# EAGLE design STEP6 (EAGLE 9.4.2)
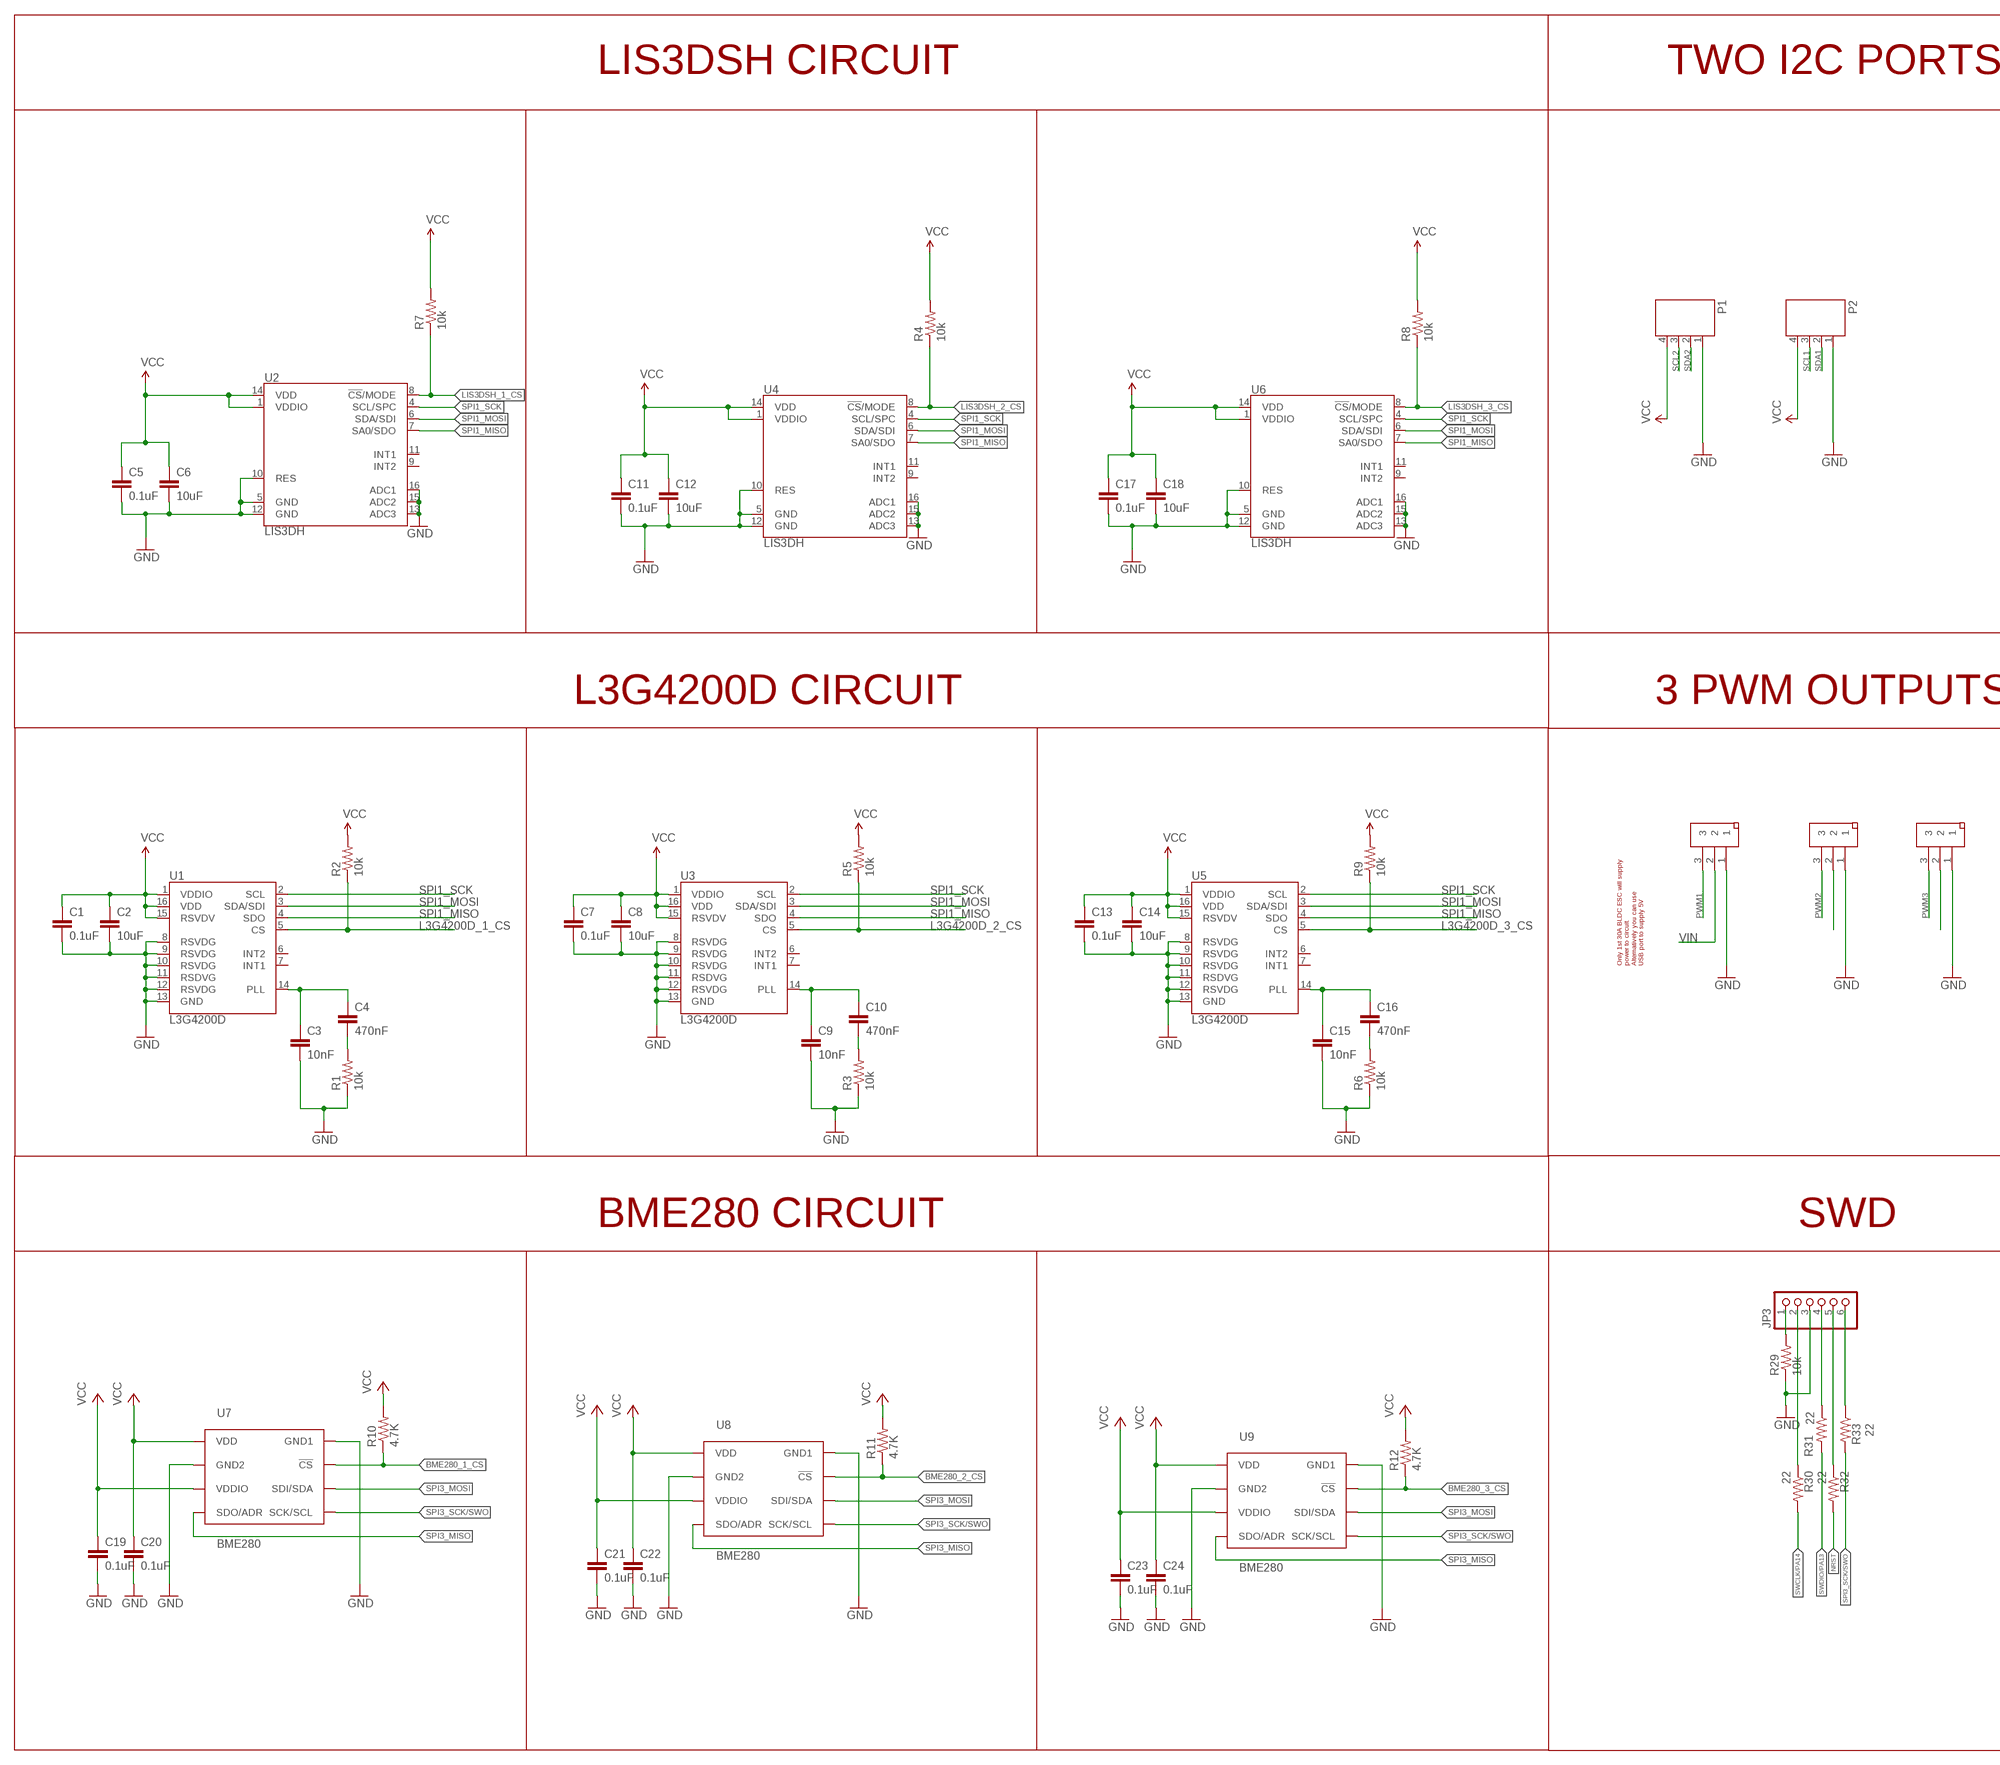
[diagram p0: schematic, sheet 1, part 1 of 2]
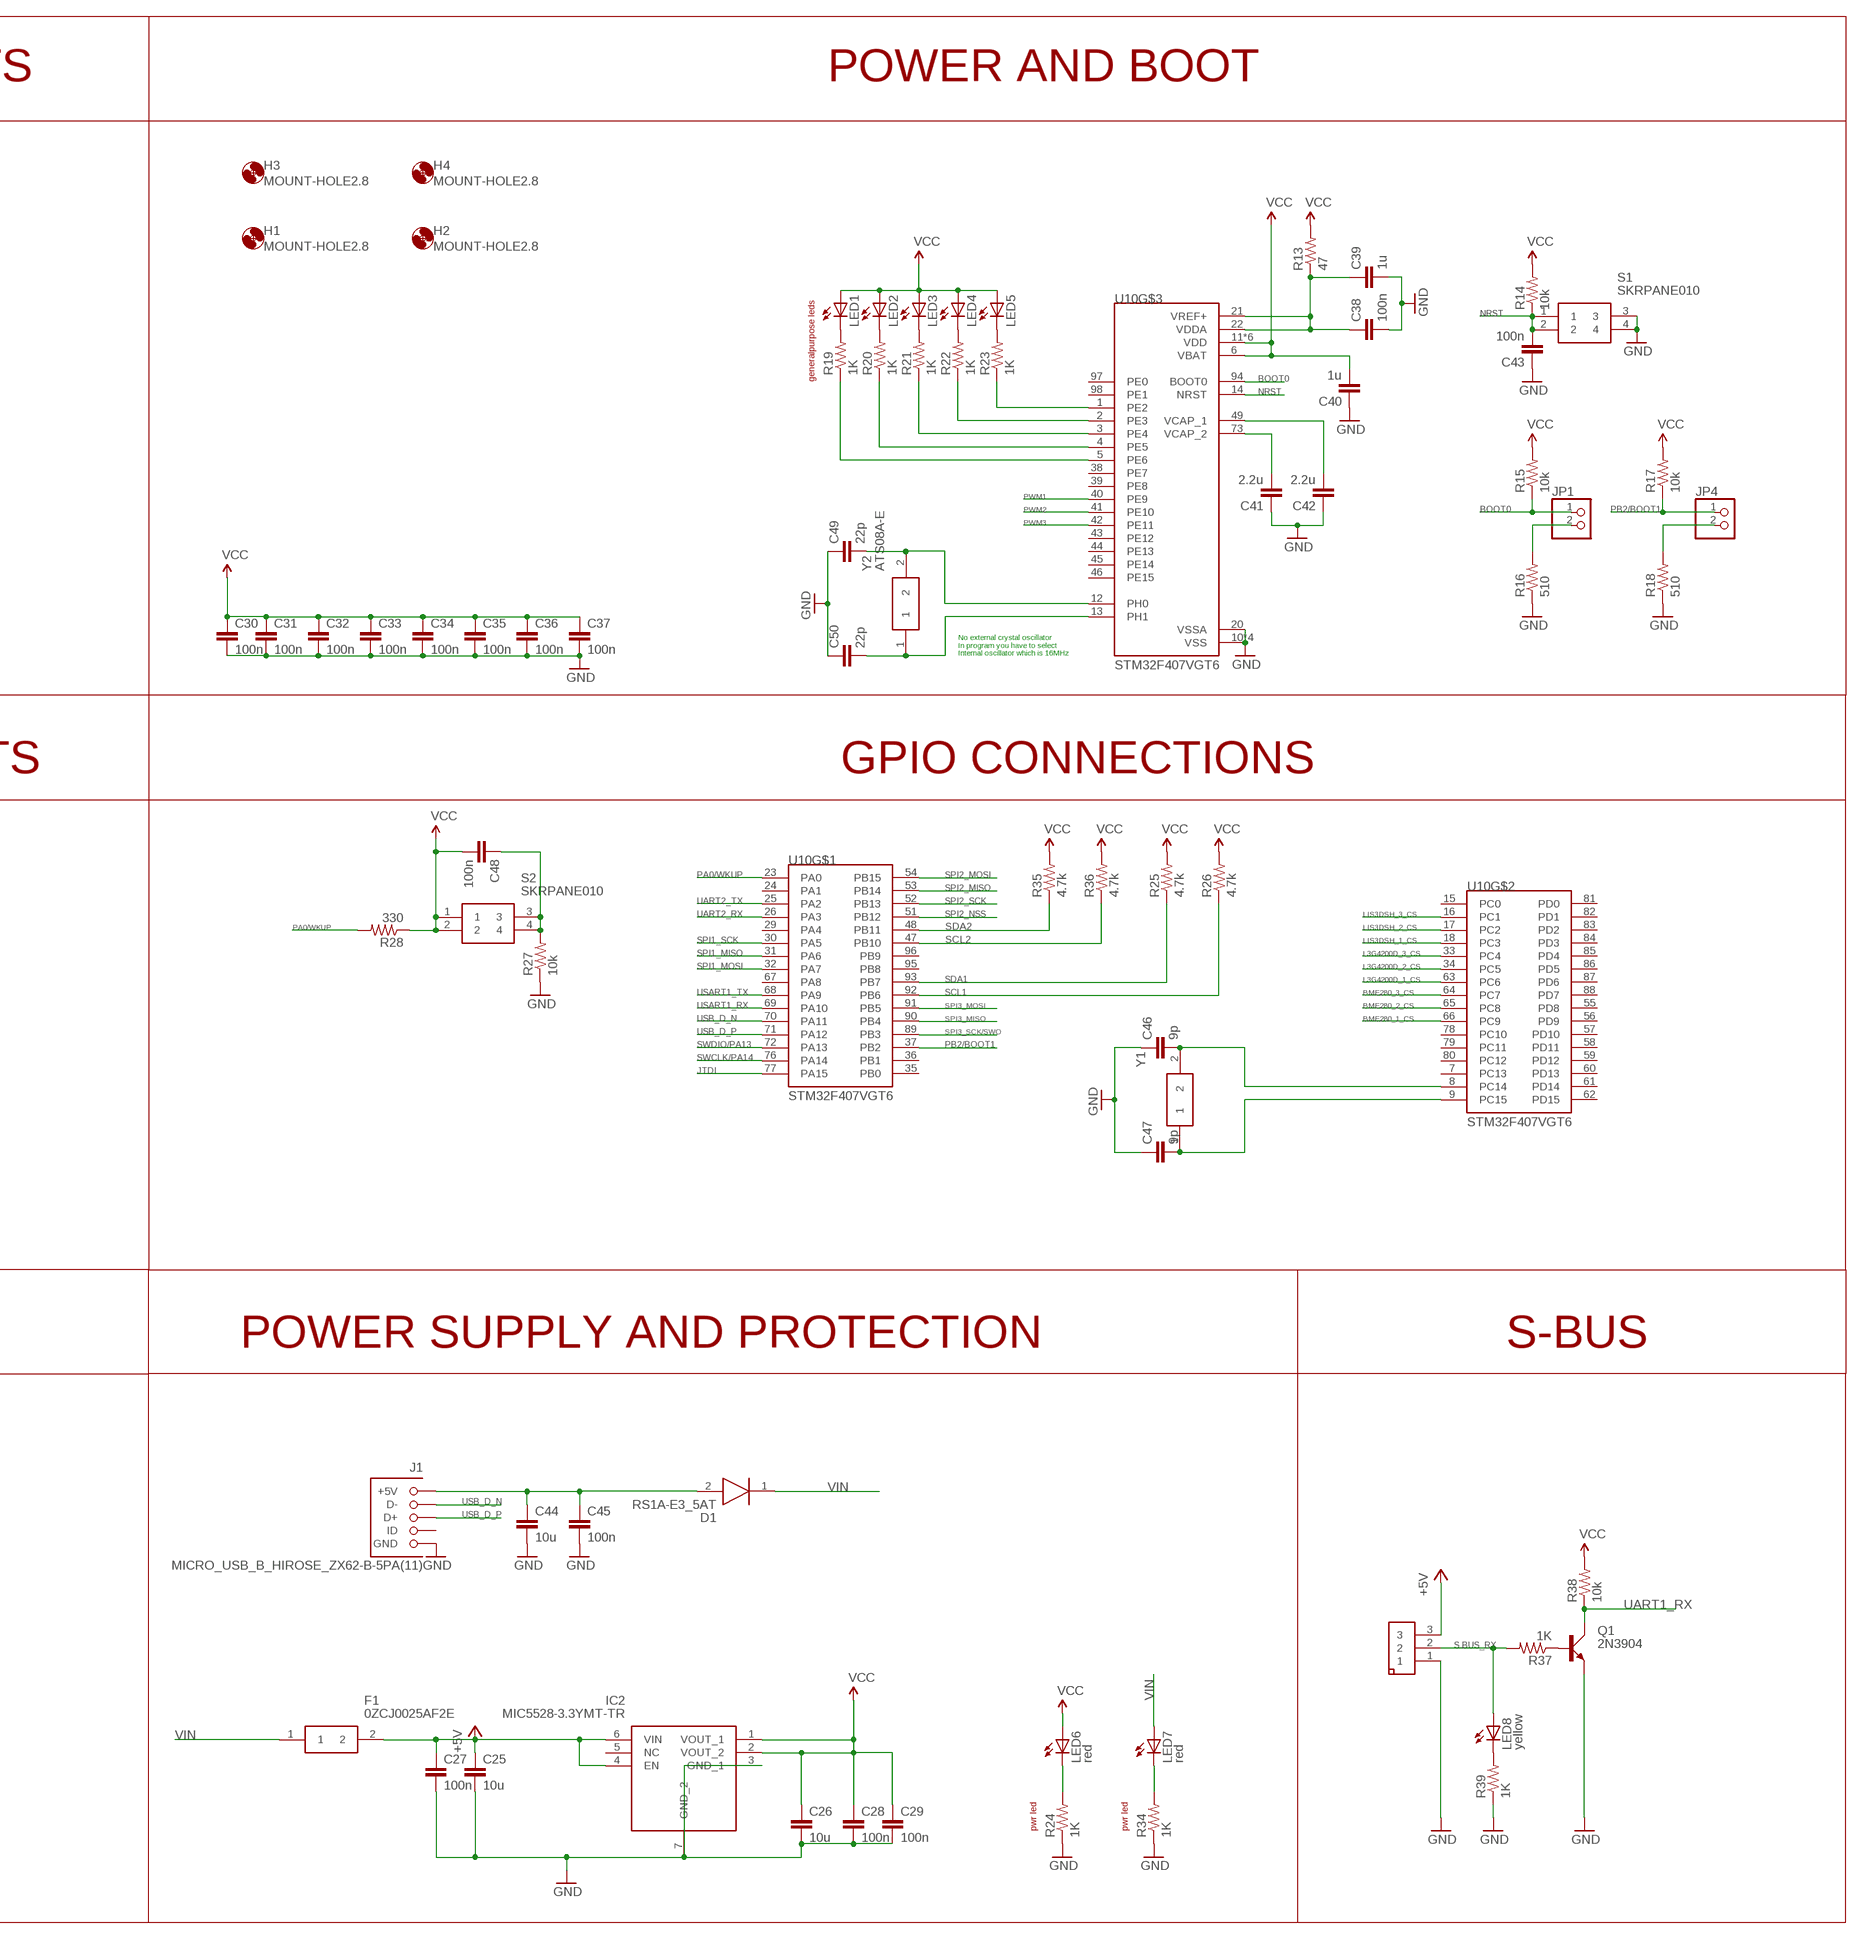
[diagram p1: schematic, sheet 1, part 2 of 2]

## Parts
C1  0.1uF  CAP0402-CAP  [0402-CAP]
C2  10uF  CAP1206  [1206]
C3  10nF  CAP0402-CAP  [0402-CAP]
C4  470nF  CAP0402-CAP  [0402-CAP]
C5  0.1uF  0.1UF-0402-16V-10%  [0402]
C6  10uF  10UF-0603-6.3V-20%  [0603]
C7  0.1uF  CAP0402-CAP  [0402-CAP]
C8  10uF  CAP1206  [1206]
C9  10nF  CAP0402-CAP  [0402-CAP]
C10  470nF  CAP0402-CAP  [0402-CAP]
C11  0.1uF  0.1UF-0402-16V-10%  [0402]
C12  10uF  10UF-0603-6.3V-20%  [0603]
C13  0.1uF  CAP0402-CAP  [0402-CAP]
C14  10uF  CAP1206  [1206]
C15  10nF  CAP0402-CAP  [0402-CAP]
C16  470nF  CAP0402-CAP  [0402-CAP]
C17  0.1uF  0.1UF-0402-16V-10%  [0402]
C18  10uF  10UF-0603-6.3V-20%  [0603]
C19  0.1uF  0.1UF-25V-5%(0603)  [0603-CAP]
C20  0.1uF  0.1UF-25V-5%(0603)  [0603-CAP]
C21  0.1uF  0.1UF-25V-5%(0603)  [0603-CAP]
C22  0.1uF  0.1UF-25V-5%(0603)  [0603-CAP]
C23  0.1uF  0.1UF-25V-5%(0603)  [0603-CAP]
C24  0.1uF  0.1UF-25V-5%(0603)  [0603-CAP]
C25  10u  C-EUC0805  [C0805]
C26  10u  C-EUC0805  [C0805]
C27  100n  C-EUC0402  [C0402]
C28  100n  C-EUC0402  [C0402]
C29  100n  C-EUC0402  [C0402]
C30  100n  C-EUC0402  [C0402]
C31  100n  C-EUC0402  [C0402]
C32  100n  C-EUC0402  [C0402]
C33  100n  C-EUC0402  [C0402]
C34  100n  C-EUC0402  [C0402]
C35  100n  C-EUC0402  [C0402]
C36  100n  C-EUC0402  [C0402]
C37  100n  C-EUC0402  [C0402]
C38  100n  C-EUC0402  [C0402]
C39  1u  C-EUC0402  [C0402]
C40  1u  C-EUC0402  [C0402]
C41  2.2u  C-EUC0603  [C0603]
C42  2.2u  C-EUC0603  [C0603]
C43  100n  C-EUC0402  [C0402]
C44  10u  C-EUC0805  [C0805]
C45  100n  C-EUC0402  [C0402]
C46  9p  C-EUC0402  [C0402]
C47  9p  C-EUC0402  [C0402]
C48  100n  C-EUC0402  [C0402]
C49  22p  C-EUC0402  [C0402]
C50  22p  C-EUC0402  [C0402]
D1  RS1A-E3_5AT  [DIOM5127X229N]
F1  0ZCJ0025AF2E  [FUSC3216X75N]
H1  MOUNT-HOLE2.8  [2,8]
H2  MOUNT-HOLE2.8  [2,8]
H3  MOUNT-HOLE2.8  [2,8]
H4  MOUNT-HOLE2.8  [2,8]
IC2  MIC5528-3.3YMT-TR  [SON40P120X120X60-7N]
J1  MICRO_USB_B_HIROSE_ZX62-B-5PA(11)  [USB_MICRO_B-HIROSE-ZX62-B-5PA(11)]
JP1  PINHD-1X2  [1X02]
JP3  PINHD-1X6  [1X06]
JP4  PINHD-1X2  [1X02]
LED1  LEDCHIP-LED0603  [CHIP-LED0603]
LED2  LEDCHIP-LED0603  [CHIP-LED0603]
LED3  LEDCHIP-LED0603  [CHIP-LED0603]
LED4  LEDCHIP-LED0603  [CHIP-LED0603]
LED5  LEDCHIP-LED0603  [CHIP-LED0603]
LED6  red  LEDCHIP-LED0603  [CHIP-LED0603]
LED7  red  LEDCHIP-LED0603  [CHIP-LED0603]
LED8  yellow  LEDCHIP-LED0603  [CHIP-LED0603]
P1  JST-PH4  [JST-PH4]
P2  JST-PH4  [JST-PH4]
Q1  2N3904  [SOT23]
R1  10k  RESISTOR0402-RES  [0402-RES]
R2  10k  RESISTOR0402-RES  [0402-RES]
R3  10k  RESISTOR0402-RES  [0402-RES]
R4  10k  R-US_R0402  [R0402]
R5  10k  RESISTOR0402-RES  [0402-RES]
R6  10k  RESISTOR0402-RES  [0402-RES]
R7  10k  R-US_R0402  [R0402]
R8  10k  R-US_R0402  [R0402]
R9  10k  RESISTOR0402-RES  [0402-RES]
R10  4.7K  R-US_R0402  [R0402]
R11  4.7K  R-US_R0402  [R0402]
R12  4.7K  R-US_R0402  [R0402]
R13  47  R-US_R1206  [R1206]
R14  10k  R-US_R0402  [R0402]
R15  10k  R-US_R0402  [R0402]
R16  510  R-US_R0402  [R0402]
R17  10k  R-US_R0402  [R0402]
R18  510  R-US_R0402  [R0402]
R19  1K  R-US_R0402  [R0402]
R20  1K  R-US_R0402  [R0402]
R21  1K  R-US_R0402  [R0402]
R22  1K  R-US_R0402  [R0402]
R23  1K  R-US_R0402  [R0402]
R24  1K  R-US_R0402  [R0402]
R25  4.7k  R-US_R0402  [R0402]
R26  4.7k  R-US_R0402  [R0402]
R27  10k  R-US_R0402  [R0402]
R28  330  R-US_R0402  [R0402]
R29  10k  RESISTOR0402-RES  [0402-RES]
R30  22  RESISTOR0402-RES  [0402-RES]
R31  22  RESISTOR0402-RES  [0402-RES]
R32  22  RESISTOR0402-RES  [0402-RES]
R33  22  RESISTOR0402-RES  [0402-RES]
R34  1K  R-US_R0402  [R0402]
R35  4.7k  R-US_R0402  [R0402]
R36  4.7k  R-US_R0402  [R0402]
R37  1K  R-US_R0402  [R0402]
R38  10k  R-US_R0402  [R0402]
R39  1K  R-US_R0402  [R0402]
S1  SKRPANE010  [SKRPADE010]
S2  SKRPANE010  [SKRPADE010]
U1  L3G4200D  [LGA16-4X4]
U2  LIS3DH  [LGA-16-3X3]
U3  L3G4200D  [LGA16-4X4]
U4  LIS3DH  [LGA-16-3X3]
U5  L3G4200D  [LGA16-4X4]
U6  LIS3DH  [LGA-16-3X3]
U7  BME280  [BME280_LGA]
U8  BME280  [BME280_LGA]
U9  BME280  [BME280_LGA]
U10  STM32F407VGT6  [QFP50P1600X1600X160-100N]
U$1  JST-PH3  [JST-PH3]
U$2  JST-PH3  [JST-PH3]
U$3  JST-PH3  [JST-PH3]
U$4  JST-PH3  [JST-PH3]
Y1  CM7V-T1A-32.768K-9PF-20PPM-TA-  [CM7VT1A32768KHZ125PF10PPMTBQC]
Y2  ATS08A-E  [ATS041C-E]

## Nets
+5V: C25.1 C27.1 F1.2 IC2.4(EN) IC2.6(VIN) U$4.3
BME280_1_CS: R10.1 U7.P$2(!CS) U10.66(PC9)
BME280_2_CS: R11.1 U8.P$2(!CS) U10.65(PC8)
BME280_3_CS: R12.1 U9.P$2(!CS) U10.64(PC7)
BOOT0: JP1.1 R15.1 U10.94(BOOT0)
GND: C1.2 C2.2 C3.2 C5.2 C6.2 C7.2 C8.2 C9.2 C11.2 C12.2 C13.2 C14.2 C15.2 C17.2 C18.2 C19.2 C20.2 C21.2 C22.2 C23.2 C24.2 C25.2 C26.2 C27.2 C28.2 C29.2 C30.2 C31.2 C32.2 C33.2 C34.2 C35.2 C36.2 C37.2 C38.2 C39.2 C40.1 C41.1 C42.1 C43.1 C44.2 C45.2 C46.1 C47.1 C49.1 C50.1 IC2.3(GND_1) IC2.7(GND_2) J1.5(GND) JP3.3 P1.1 P2.1 Q1.2(E) R1.1 R3.1 R6.1 R16.1 R18.1 R24.1 R27.1 R29.1 R34.1 R39.1 S1.3 S1.4 U1.8(RSVDG) U1.9(RSVDG) U1.10(RSVDG) U1.11(RSDVG) U1.12(RSVDG) U1.13(GND) U2.5(GND) U2.10(RES) U2.12(GND) U2.13(ADC3) U2.15(ADC2) U2.16(ADC1) U3.8(RSVDG) U3.9(RSVDG) U3.10(RSVDG) U3.11(RSDVG) U3.12(RSVDG) U3.13(GND) U4.5(GND) U4.10(RES) U4.12(GND) U4.13(ADC3) U4.15(ADC2) U4.16(ADC1) U5.8(RSVDG) U5.9(RSVDG) U5.10(RSVDG) U5.11(RSDVG) U5.12(RSVDG) U5.13(GND) U6.5(GND) U6.10(RES) U6.12(GND) U6.13(ADC3) U6.15(ADC2) U6.16(ADC1) U7.P$1(GND1) U7.P$7(GND2) U8.P$1(GND1) U8.P$7(GND2) U9.P$1(GND1) U9.P$7(GND2) U10.10(VSS) U10.20(VSSA) U10.27(VSS) U10.74(VSS) U10.99(VSS) U$1.1 U$2.1 U$3.1 U$4.1
JTDI: U10.77(PA15)
L3G4200D_1_CS: R2.1 U1.5(CS) U10.63(PC6)
L3G4200D_2_CS: R5.1 U3.5(CS) U10.34(PC5)
L3G4200D_3_CS: R9.1 U5.5(CS) U10.33(PC4)
LIS3DSH_1_CS: R7.1 U2.8(!CS!/MODE) U10.18(PC3)
LIS3DSH_2_CS: R4.1 U4.8(!CS!/MODE) U10.17(PC2)
LIS3DSH_3_CS: R8.1 U6.8(!CS!/MODE) U10.16(PC1)
N$10: C42.2 U10.49(VCAP_1)
N$11: C38.1 C39.1 R13.1 U10.21(VREF+) U10.22(VDDA)
N$12: C41.2 U10.73(VCAP_2)
N$13: JP1.2 R16.2
N$14: LED1.C R19.2
N$15: JP4.2 R18.2
N$16: LED2.C R20.2
N$17: LED3.C R21.2
N$18: LED4.C R22.2
N$19: LED5.C R23.2
N$20: R23.1 U10.1(PE2)
N$21: LED6.C R24.2
N$22: R22.1 U10.2(PE3)
N$23: R21.1 U10.3(PE4)
N$24: R20.1 U10.4(PE5)
N$25: R19.1 U10.5(PE6)
N$26: C46.2 U10.8(PC14) Y1.2
N$27: C47.2 U10.9(PC15) Y1.1
N$28: C48.1 R27.2 S2.3 S2.4
N$29: JP3.1 R29.2
N$30: JP3.2 R30.1
N$31: JP3.4 R31.1
N$32: JP3.5 R32.1
N$33: JP3.6 R33.1
N$34: C49.2 U10.12(PH0) Y2.2
N$35: C50.2 U10.13(PH1) Y2.1
N$36: U$3.2
N$37: LED7.C R34.2
N$39: U$2.2
N$40: Q1.1(B) R37.1
N$41: LED8.C R39.2
NRST: C43.2 R14.1 R32.2 S1.1 S1.2 U10.14(NRST)
PA0/WKUP: R28.2 U10.23(PA0)
PB2/BOOT1: JP4.1 R17.1 U10.37(PB2)
PLL: C3.1 C4.1 U1.14(PLL)
PLL1: C9.1 C10.1 U3.14(PLL)
PLL2: C15.1 C16.1 U5.14(PLL)
PLL-1: C10.2 R3.2
PLL-2: C4.2 R1.2
PLL-3: C16.2 R6.2
PWM1: U10.40(PE9) U$1.3
PWM2: U10.41(PE10) U$2.3
PWM3: U10.42(PE11) U$3.3
S.BUS_RX: LED8.A R37.2 U$4.2
SCL1: P2.3 R26.1 U10.92(PB6)
SCL2: P1.3 R36.1 U10.47(PB10)
SDA1: P2.2 R25.1 U10.93(PB7)
SDA2: P1.2 R35.1 U10.48(PB11)
SPI1_MISO: U1.4(SDO) U2.7(SA0/SDO) U3.4(SDO) U4.7(SA0/SDO) U5.4(SDO) U6.7(SA0/SDO) U10.31(PA6)
SPI1_MOSI: U1.3(SDA/SDI) U2.6(SDA/SDI) U3.3(SDA/SDI) U4.6(SDA/SDI) U5.3(SDA/SDI) U6.6(SDA/SDI) U10.32(PA7)
SPI1_SCK: U1.2(SCL) U2.4(SCL/SPC) U3.2(SCL) U4.4(SCL/SPC) U5.2(SCL) U6.4(SCL/SPC) U10.30(PA5)
SPI2_MISO: U10.53(PB14)
SPI2_MOSI: U10.54(PB15)
SPI2_NSS: U10.51(PB12)
SPI2_SCK: U10.52(PB13)
SPI3_MISO: U7.P$5(SDO/ADR) U8.P$5(SDO/ADR) U9.P$5(SDO/ADR) U10.90(PB4)
SPI3_MOSI: U7.P$3(SDI/SDA) U8.P$3(SDI/SDA) U9.P$3(SDI/SDA) U10.91(PB5)
SPI3_SCK/SWO: R33.2 U7.P$4(SCK/SCL) U8.P$4(SCK/SCL) U9.P$4(SCK/SCL) U10.89(PB3)
SWCLK/PA14: R30.2 U10.76(PA14)
SWDIO/PA13: R31.2 U10.72(PA13)
UART1_RX: Q1.3(C) R38.1
UART2_RX: U10.26(PA3)
UART2_TX: U10.25(PA2)
USART1_RX: U10.69(PA10)
USART1_TX: U10.68(PA9)
USB_D_N: J1.2(D-) U10.70(PA11)
USB_D_P: J1.3(D+) U10.71(PA12)
VCC: C1.1 C2.1 C5.1 C6.1 C7.1 C8.1 C11.1 C12.1 C13.1 C14.1 C17.1 C18.1 C19.1 C20.1 C21.1 C22.1 C23.1 C24.1 C26.1 C28.1 C29.1 C30.1 C31.1 C32.1 C33.1 C34.1 C35.1 C36.1 C37.1 C40.2 C48.2 IC2.1(VOUT_1) IC2.2(VOUT_2) LED1.A LED2.A LED3.A LED4.A LED5.A LED6.A P1.4 P2.4 R2.2 R4.2 R5.2 R7.2 R8.2 R9.2 R10.2 R11.2 R12.2 R13.2 R14.2 R15.2 R17.2 R25.2 R26.2 R28.1 R35.2 R36.2 R38.2 S2.1 S2.2 U1.1(VDDIO) U1.15(RSVDV) U1.16(VDD) U2.1(VDDIO) U2.14(VDD) U3.1(VDDIO) U3.15(RSVDV) U3.16(VDD) U4.1(VDDIO) U4.14(VDD) U5.1(VDDIO) U5.15(RSVDV) U5.16(VDD) U6.1(VDDIO) U6.14(VDD) U7.P$6(VDDIO) U7.P$8(VDD) U8.P$6(VDDIO) U8.P$8(VDD) U9.P$6(VDDIO) U9.P$8(VDD) U10.6(VBAT) U10.11(VDD) U10.19(VDD) U10.28(VDD) U10.50(VDD) U10.75(VDD) U10.100(VDD)
VIN: D1.1(K) F1.1 LED7.A U$1.2
VUSB: C44.1 C45.1 D1.2(A) J1.1(+5V)
Unconnected: IC2.5(NC) J1.4(ID) U1.6(INT2) U1.7(INT1) U2.9(INT2) U2.11(INT1) U3.6(INT2) U3.7(INT1) U4.9(INT2) U4.11(INT1) U5.6(INT2) U5.7(INT1) U6.9(INT2) U6.11(INT1) U10.7(PC13) U10.15(PC0) U10.24(PA1) U10.29(PA4) U10.35(PB0) U10.36(PB1) U10.38(PE7) U10.39(PE8) U10.43(PE12) U10.44(PE13) U10.45(PE14) U10.46(PE15) U10.55(PD8) U10.56(PD9) U10.57(PD10) U10.58(PD11) U10.59(PD12) U10.60(PD13) U10.61(PD14) U10.62(PD15) U10.67(PA8) U10.78(PC10) U10.79(PC11) U10.80(PC12) U10.81(PD0) U10.82(PD1) U10.83(PD2) U10.84(PD3) U10.85(PD4) U10.86(PD5) U10.87(PD6) U10.88(PD7) U10.95(PB8) U10.96(PB9) U10.97(PE0) U10.98(PE1)

## Notes on the sheet
- LIS3DSH CIRCUIT | TWO I2C PORTS | POWER AND BOOT
- generalpurpose leds
- No external crystal oscillator
  In program you have to select
  Internal oscillator which is 16MHz
- L3G4200D CIRCUIT | 3 PWM OUTPUTS | GPIO CONNECTIONS
- Only 1st 30A BLDC ESC will supply
  power to circuit.
  Alternatively you can use 
  USB port to supply 5V
- BME280 CIRCUIT | SWD | POWER SUPPLY AND PROTECTION | S-BUS
- pwr led | pwr led

## Library data of the parts
C1-C4 C7-C10 C13-C16 = SparkFun:CAP: Capacitor Standard 0603 ceramic capacitor, and 0.1" leaded capacitor.
C5 C11 C17 = SparkFun-Capacitors:0.1UF: 0.1µF ceramic capacitors A capacitor is a passive two-terminal electrical component used to store electrical energy temporarily in an electric field.; PROD_ID: CAP-12416
C6 C12 C18 = SparkFun-Capacitors:10UF: 10.0µF ceramic capacitors A capacitor is a passive two-terminal electrical component used to store electrical energy temporarily in an electric field.; PROD_ID: CAP-11015
C19-C24 = SparkFun-Capacitors:0.1UF-25V-5%(0603): CAP-08604; PROD_ID: CAP-08604
C25-C50 = rcl:C-EU: CAPACITOR, European symbol
D1 = SamacSys_Parts:RS1A-E3_5AT: VISHAY - RS1A-E3/5AT - DIODE, FAST, 1A, 50V, SMD Source: Datasheet <https://www.vishay.com/docs/88707/rs1a.pdf>; DESCRIPTION: VISHAY - RS1A-E3/5AT - DIODE, FAST, 1A, 50V, SMD; HEIGHT: 2.29mm; MANUFACTURER_NAME: Vishay; MANUFACTURER_PART_NUMBER: RS1A-E3/5AT; MOUSER_PART_NUMBER: 625-RS1A-E3/5AT; MOUSER_PRICE-STOCK: https://www.mouser.com/Search/Refine.aspx?Keyword=625-RS1A-E3%2F5AT
F1 = SamacSys_Parts:0ZCJ0025AF2E: BEL FUSE - CIRCUIT PROTECTION - 0ZCJ0025AF2E - FUSE, RESETTABLE PTC, 24VDC, 0.25A, SMD Source: Datasheet <https://www.belfuse.com/resources/CircuitProtection/datasheets/0ZCJ Nov2016.pdf>; DESCRIPTION: BEL FUSE - CIRCUIT PROTECTION - 0ZCJ0025AF2E - FUSE, RESETTABLE PTC, 24VDC, 0.25A, SMD; HEIGHT: 0.75mm; MANUFACTURER_NAME: BEL CIRCUIT PROTECTION; MANUFACTURER_PART_NUMBER: 0ZCJ0025AF2E
H1-H4 = holes:MOUNT-HOLE: MOUNTING HOLE with drill center marker
IC2 = SamacSys_Parts:MIC5528-3.3YMT-TR: LDO Voltage Regulators High-Performance 500mA LDO Source: Datasheet <https://componentsearchengine.com/Datasheets/1/MIC5528-3.3YMT-TR.pdf>; DESCRIPTION: LDO Voltage Regulators High-Performance 500mA LDO; HEIGHT: 0.6mm; MANUFACTURER_NAME: Microchip; MANUFACTURER_PART_NUMBER: MIC5528-3.3YMT-TR; MOUSER_PART_NUMBER: 998-MIC5528-3.3YMTTR; MOUSER_PRICE-STOCK: https://www.mouser.com/Search/Refine.aspx?Keyword=998-MIC5528-3.3YMTTR; RS_PART_NUMBER: 1773292P; RS_PRICE-STOCK: http://uk.rs-online.com/web/p/products/1773292P
J1 = connector:MICRO_USB_B_HIROSE_ZX62-B-5PA(11): Connector Receptacle USB - micro B 2.0 5 Position Surface Mount, Right Angle, Horizontal Bottom Mount; DIGIKEY: H11634CT-ND; MOUSER: 798-ZX62-B-5PA11; NEWARK: 86P8793
JP1 JP4 = pinhead:PINHD-1X2: PIN HEADER
JP3 = pinhead:PINHD-1X6: PIN HEADER
LED1-LED8 = led:LED: LED OSRAM: - CHIPLED LG R971, LG N971, LY N971, LG Q971, LY Q971, LO R971, LY R971 LH N974, LH R974 LS Q976, LO Q976, LY Q976 LO Q996 - Hyper CHIPLED LW Q18S LB Q993, LB Q99A, LB R99A - SideLED LS A670, LO A670, LY A670, LG A670, LP A670 LB A673, LV A673, LT A673, LW A673 LH A674 LY A675 LS A676, LA A676, LO A676, LY A676, LW A676 LS A679, LY A679, LG A679 - Hyper Micro SIDELED® LS Y876, LA Y876, LO Y876, LY Y876 LT Y87S - SmartLED LW L88C, LW L88S LB L89C, LB L89S, LG L890 LS L89K, LO L89K, LY L89K LS L896, LA L896, LO L896, LY L896 - TOPLED LS T670, LO T670, LY T670, LG T670, LP T670 LSG T670, LSP T670, LSY T670, LOP T670, LYG T670 LG T671, LOG T671, LSG T671 LB T673, LV T673, LT T673, LW T673 LH T674 LS T676, LA T676, LO T676, LY T676, LB T676, LH T676, LSB T676, LW T676 LB T67C, LV T67C, LT T67C, LS T67K, LO T67K, LY T67K, LW E67C LS E67B, LA E67B, LO E67B, LY E67B, LB E67C, LV E67C, LT E67C LW T67C LS T679, LY T679, LG T679 LS T770, LO T770, LY T770, LG T770, LP T770 LB T773, LV T773, LT T773, LW T773 LH T774 LS E675, LA E675, LY E675, LS T675 LS T776, LA T776, LO T776, LY T776, LB T776 LHGB T686 LT T68C, LB T68C - Hyper Mini TOPLED® LB M676 - Mini TOPLED Santana® LG M470 LS M47K, LO M47K, LY M47K Source: http://www.osram.convergy.de LUXEON: - LUMILED® LXK2-PW12-R00, LXK2-PW12-S00, LXK2-PW14-U00, LXK2-PW14-V00 LXK2-PM12-R00, LXK2-PM12-S00, LXK2-PM14-U00 LXK2-PE12-Q00, LXK2-PE12-R00, LXK2-PE12-S00, LXK2-PE14-T00, LXK2-PE14-U00 LXK2-PB12-K00, LXK2-PB12-L00, LXK2-PB12-M00, LXK2-PB14-N00, LXK2-PB14-P00, LXK2-PB14-Q00 LXK2-PR12-L00, LXK2-PR12-M00, LXK2-PR14-Q00, LXK2-PR14-R00 LXK2-PD12-Q00, LXK2-PD12-R00, LXK2-PD12-S00 LXK2-PH12-R00, LXK2-PH12-S00 LXK2-PL12-P00, LXK2-PL12-Q00, LXK2-PL12-R00 Source: www.luxeon.com KINGBRIGHT: KA-3528ASYC Source: www.kingbright.com
P1 P2 = jst-ph:JST-PH4
Q1 = transistor-small-signal:2N3904: NPN TRANSISTOR
R1-R3 R5 R6 R9 R29-R33 = SparkFun:RESISTOR: Resistor Basic schematic elements and footprints for 0603, 1206, and PTH resistors.
R4 R7 R8 R10-R28 R34-R39 = rcl:R-US_: RESISTOR, American symbol
S1 S2 = SamacSys_Parts:SKRPANE010: Tactile Switches 500mOhm 1.57N 16VDC 4.2X3.2X2.5MM 50mA Source: Datasheet <https://www.alps.com/prod/info/E/HTML/Tact/SurfaceMount/SKRP/SKRPANE010.html>; DESCRIPTION: Tactile Switches 500mOhm 1.57N 16VDC 4.2X3.2X2.5MM 50mA; HEIGHT: 2mm; MANUFACTURER_NAME: ALPS; MANUFACTURER_PART_NUMBER: SKRPANE010; MOUSER_PART_NUMBER: 688-SKRPANE010; MOUSER_PRICE-STOCK: https://www.mouser.com/Search/Refine.aspx?Keyword=688-SKRPANE010
U1 U3 U5 = SparkFun:L3G4200D: L3G4200D Three-axis, digital output gyroscope The L3G4200D is a low-power three-axis angular rate sensor, has a full scale of ±250/±500/±2000 dps and is capable of measuring rates with a user-selectable bandwidth. It includes a sensing element and an IC interface capable of providing the measured angular rate to the external world through a digital interface (I2C/SPI). Package: 4x4x1.1 LGA-16 (LGA16-4x4.PAC)
U2 U4 U6 = SparkFun-Sensors:LIS3DH: ST Microelectronics LIS3DH 3-Axis ±2/4/8/16g SPI/I2C Accelerometer The LIS3DH is a three axis MEMS linear accelerometer in the "nano" family. It has a digital I2C/SPI serial interface which makes it ideal for using in embedded applications. The device also features ultra low-power operational modes that allow advanced power saving and smart sleep to wake-up functions, built in detections with interrupts, and auxiliary ADC inputs Datasheet-XXXX <http://www.sparkfun.com/datasheets/Sensors/Accelerometer/LIS3DH.pdf> SparkFun Products SparkFun Triple Axis Accelerometer Breakout - LIS3DH <https://www.sparkfun.com/products/10345> (SEN-XXXXX) Triple Axis Accelerometer - LIS3DH <https://www.sparkfun.com/products/9755> (SEN-XXXXX); PROD_ID: IC-13419; SF_ID: N/A
U7-U9 = BME280ComponentLibrary:BME280; PROD_ID: IC-13090
U10 = STM32F407VGT6:STM32F407VGT6: STM32 Series 32-bit 1 MB Flash 192 kB RAM ARM Based Microcontroller - LQFP-100; AVAILABILITY: Unavailable; DESCRIPTION: STM32 Series 32-bit 1 MB Flash 192 kB RAM ARM Based Microcontroller - LQFP-100; MF: STMicroelectronics; MP: STM32F407VGT6; PACKAGE: LQFP-100 STMicroelectronics; PRICE: None
U$1-U$4 = jst-ph:JST-PH3
Y1 = SamacSys_Parts:CM7V-T1A-32.768K-9PF-20PPM-TA-: Crystals 32.768 kHz 9.0 pF +/-20 PPM AEC-Q200 Source: Datasheet <https://componentsearchengine.com/Datasheets/1/CM7V-T1A-32.768k-9pF-20PPM-TA-QA T3.pdf>; DESCRIPTION: Crystals 32.768 kHz 9.0 pF +/-20 PPM AEC-Q200; HEIGHT: 0.65mm; MANUFACTURER_NAME: MICRO CRYSTAL; MANUFACTURER_PART_NUMBER: CM7V-T1A-32.768k-9pF-20PPM-TA-QA T3; MOUSER_PART_NUMBER: 428-201568-MG03; MOUSER_PRICE-STOCK: https://www.mouser.com/Search/Refine.aspx?Keyword=428-201568-MG03
Y2 = SamacSys_Parts:ATS08A-E: Crystals 8MHz 20pF 30ppm -40C 85C Source: Datasheet <https://componentsearchengine.com/Datasheets/1/ATS08A-E.pdf>; DESCRIPTION: Crystals 8MHz 20pF 30ppm -40C 85C; HEIGHT: mm; MANUFACTURER_NAME: CTS; MANUFACTURER_PART_NUMBER: ATS08A-E; MOUSER_PART_NUMBER: 774-ATS08A-E; MOUSER_PRICE-STOCK: https://www.mouser.com/Search/Refine.aspx?Keyword=774-ATS08A-E

## Board
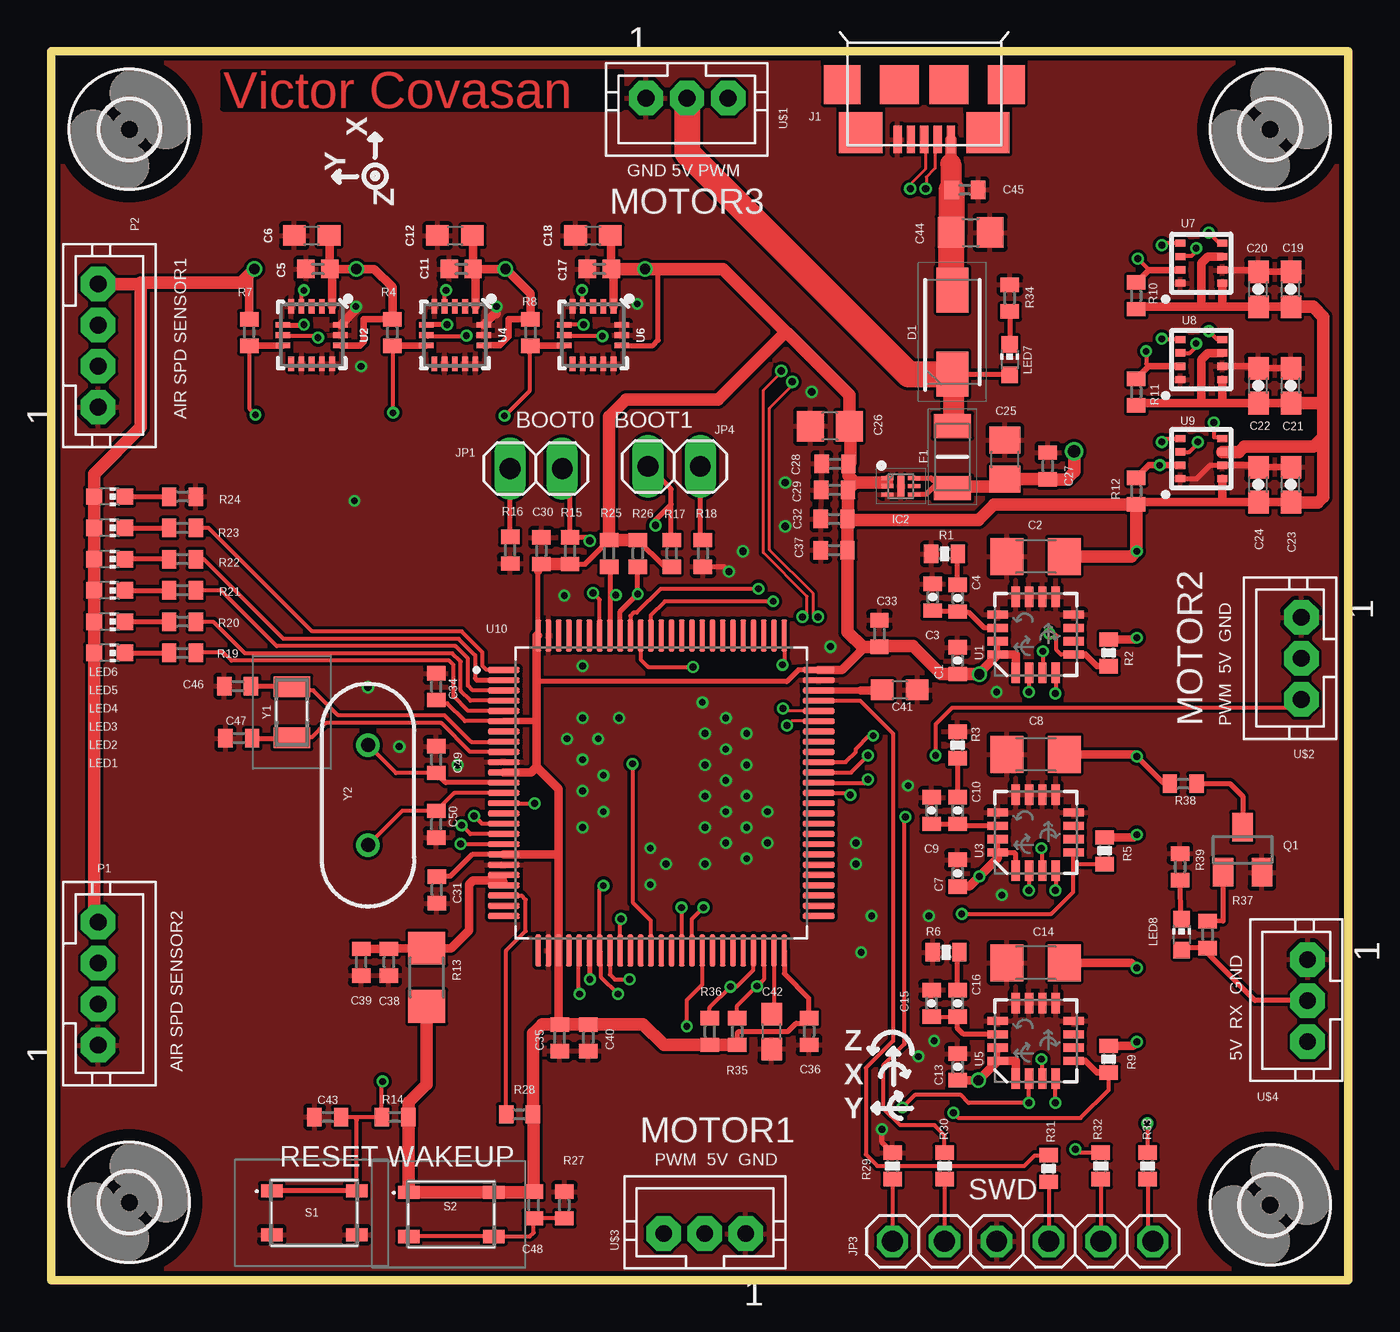
[diagram p2: board, top side]
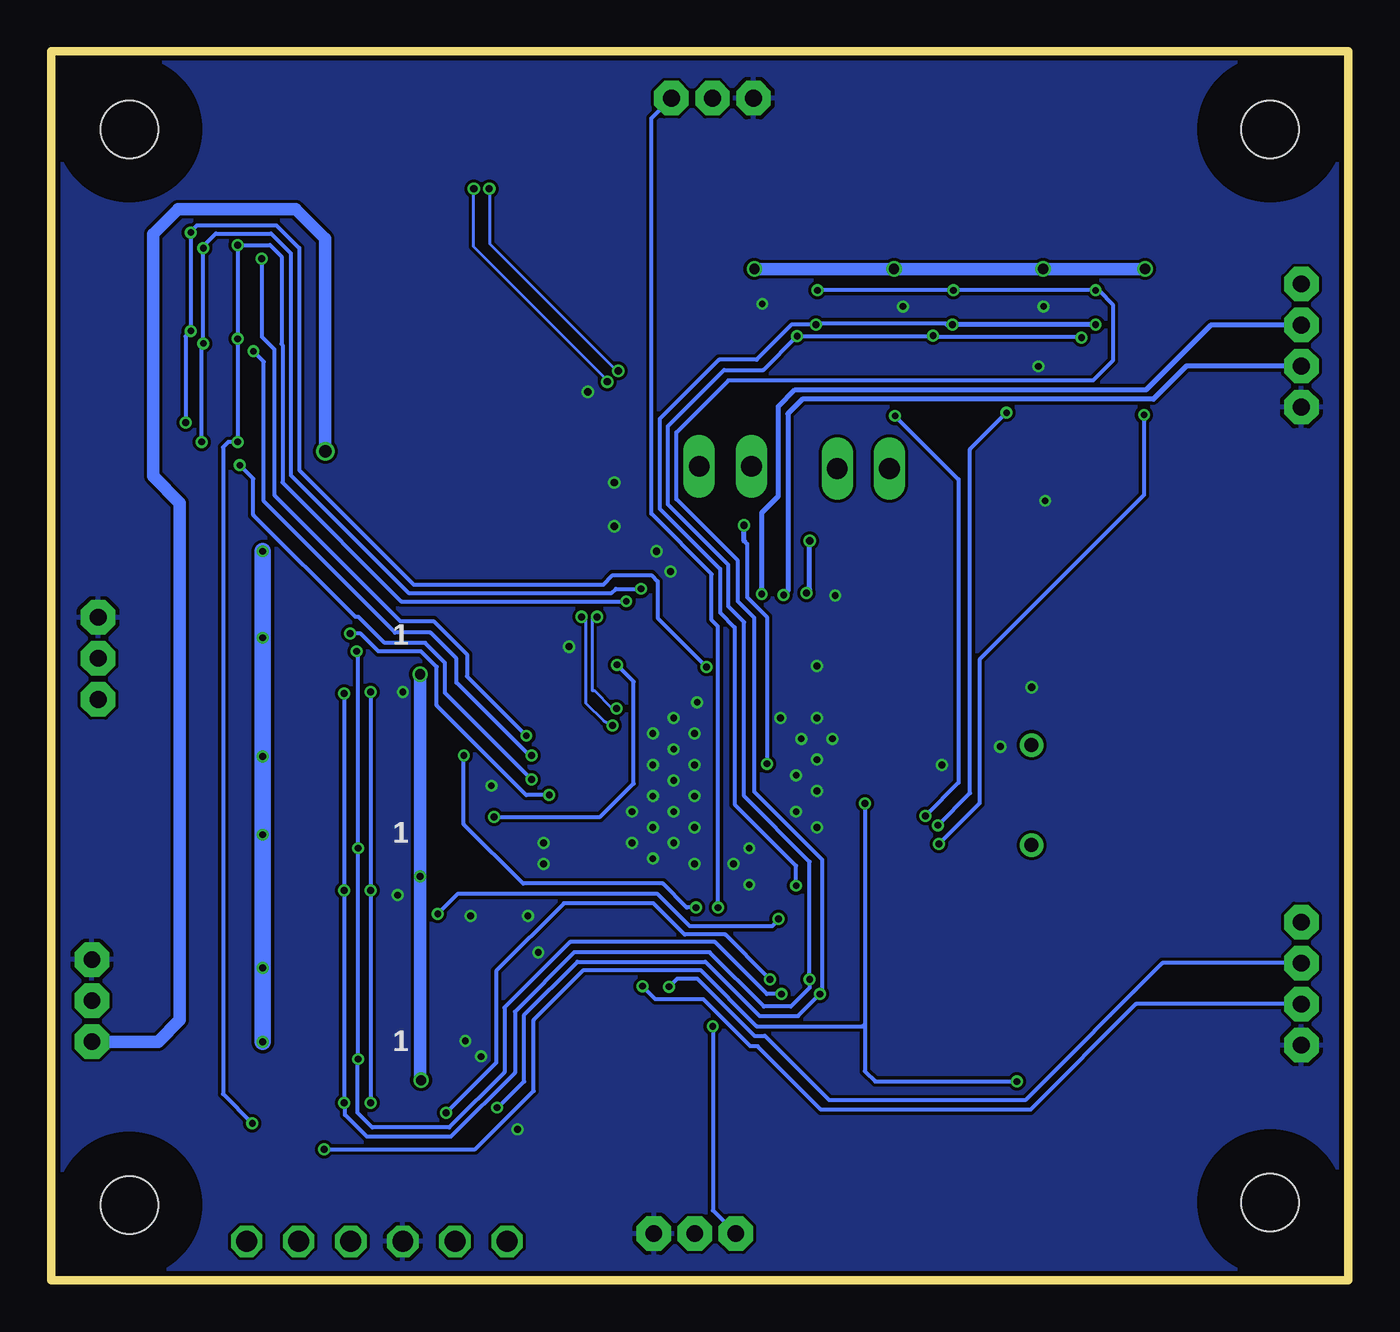
[diagram p3: board, bottom side, seen from below]

Size 63.25 x 59.94 mm. Coordinates in mm from the lower left corner, seen from the top.
Outline: 0,59.94 63.25,59.94 63.25,0 0,0 0,59.94
Copper layers (1*16): Top 0.018mm / dielectric 1.55mm / Bottom 0.018mm
Design rules "eC_2Layer_PClass6_BaseCopperO18_eCDefault *": minimum track width 0.15mm, minimum drill 0.35mm, track to track 0.15mm, track to pad 0.15mm, pad to pad 0.15mm, via to via 0.15mm, smd to smd 0mil, copper to edge 0.25mm, drill to drill 0.35mm, minimum pad ring 0.175mm, minimum via ring 0.125mm, stop-mask expansion 0mil, vias tented up to drill 0.45mm, thermal gap 0.2mm

### Footprints (pad centres in the part's own frame; a part is rotated, then mirrored left to right if it is on the bottom)
0402-CAP = smd 0.7 x 0.9: 1 -0.65,0; 2 0.65,0
1206 = smd 1.6 x 1.8: 1 -1.4,0; 2 1.4,0
0402 = smd 0.85 x 0.9: 1 -0.58,0; 2 0.58,0
0603 = smd 1.1 x 1: 1 -0.85,0; 2 0.85,0
0603-CAP = smd 1.1 x 1: 1 -0.85,0; 2 0.85,0
C0805 = smd 1.3 x 1.5: 1 -0.95,0; 2 0.95,0
C0402 = smd 0.7 x 0.9: 1 -0.65,0; 2 0.65,0
C0603 = smd 1.1 x 1: 1 -0.85,0; 2 0.85,0
DIOM5127X229N = smd 2.2 x 1.55: 1 -2.05,0; 2 2.05,0
FUSC3216X75N = smd 1.17 x 1.82: 1 -1.52,0; 2 1.52,0
2,8 = hole 2.8: 0,0
SON40P120X120X60-7N = smd 0.6 x 0.2: 1 -0.65,0.4; 2 -0.65,0; 3 -0.65,-0.4; 4 0.65,-0.4; 5 0.65,0; 6 0.65,0.4 | smd 0.35 x 0.99: 7 0,0
USB_MICRO_B-HIROSE-ZX62-B-5PA(11) = smd 0.4 x 1.35: 1 -1.3,4.125; 2 -0.65,4.125; 3 0,4.125; 4 0.65,4.125; 5 1.3,4.125 | smd 2.1 x 2: P$1 3.1,3.8; P$2 -3.1,3.8 | smd 1.8 x 1.9: P$3 -4,1.45; P$6 4,1.45 | smd 1.9 x 1.9: P$4 -1.2,1.45; P$5 1.2,1.45
1X02 = drill 1.016 long: 1 -1.27,0; 2 1.27,0
1X06 = drill 1.016 octagon: 1 -6.35,0; 2 -3.81,0; 3 -1.27,0; 4 1.27,0; 5 3.81,0; 6 6.35,0
CHIP-LED0603 = smd 0.8 x 0.8: A 0,-0.75; C 0,0.75
JST-PH4 = drill 0.813 pad 1.676 octagon: 1 3,0; 2 1,0; 3 -1,0; 4 -3,0
SOT23 = smd 1 x 1.4: 1 -0.95,-1.1; 2 0.95,-1.1; 3 0,1.1
0402-RES = smd 0.7 x 0.9: 1 -0.65,0; 2 0.65,0
R0402 = smd 0.7 x 0.9: 1 -0.65,0; 2 0.65,0
R1206 = smd 1.6 x 1.803: 1 -1.422,0; 2 1.422,0
SKRPADE010 = smd 1.05 x 0.65: 1 -1.95,1.075; 2 2.2,1.075; 3 -1.95,-1.075; 4 2.2,-1.075
LGA16-4X4 = smd 1 x 0.4: 1 -1.85,0.975; 2 -1.85,0.325; 3 -1.85,-0.325; 4 -1.85,-0.975; 9 1.85,-0.975; 10 1.85,-0.325; 11 1.85,0.325; 12 1.85,0.975 | smd 0.4 x 1: 5 -0.975,-1.85; 6 -0.325,-1.85; 7 0.325,-1.85; 8 0.975,-1.85; 13 0.975,1.85; 14 0.325,1.85; 15 -0.325,1.85; 16 -0.975,1.85
LGA-16-3X3 = smd 0.7 x 0.28: 1 -1.4,1; 2 -1.4,0.5; 3 -1.4,0; 4 -1.4,-0.5; 5 -1.4,-1; 9 1.4,-1; 10 1.4,-0.5; 11 1.4,0; 12 1.4,0.5; 13 1.4,1 | smd 0.28 x 0.7: 6 -0.5,-1.4; 7 0,-1.4; 8 0.5,-1.4; 14 0.5,1.4; 15 0,1.4; 16 -0.5,1.4
BME280_LGA = smd 0.5 x 0.35: P$1 1.025,0.975; P$2 1.025,0.325; P$3 1.025,-0.325; P$4 1.025,-0.975; P$5 -1.025,-0.975; P$6 -1.025,-0.325; P$7 -1.025,0.325; P$8 -1.025,0.975
QFP50P1600X1600X160-100N = smd 1.56 x 0.28: 1 -7.68,6; 2 -7.68,5.5; 3 -7.68,5; 4 -7.68,4.5; 5 -7.68,4; 6 -7.68,3.5; 7 -7.68,3; 8 -7.68,2.5; 9 -7.68,2; 10 -7.68,1.5; 11 -7.68,1; 12 -7.68,0.5; 13 -7.68,0; 14 -7.68,-0.5; 15 -7.68,-1; 16 -7.68,-1.5; 17 -7.68,-2; 18 -7.68,-2.5; 19 -7.68,-3; 20 -7.68,-3.5; 21 -7.68,-4; 22 -7.68,-4.5; 23 -7.68,-5; 24 -7.68,-5.5; 25 -7.68,-6; 51 7.68,-6; 52 7.68,-5.5; 53 7.68,-5; 54 7.68,-4.5; 55 7.68,-4; 56 7.68,-3.5; 57 7.68,-3; 58 7.68,-2.5; 59 7.68,-2; 60 7.68,-1.5; 61 7.68,-1; 62 7.68,-0.5; 63 7.68,0; 64 7.68,0.5; 65 7.68,1; 66 7.68,1.5; 67 7.68,2; 68 7.68,2.5; 69 7.68,3; 70 7.68,3.5; 71 7.68,4; 72 7.68,4.5; 73 7.68,5; 74 7.68,5.5; 75 7.68,6 | smd 0.28 x 1.56: 26 -6,-7.68; 27 -5.5,-7.68; 28 -5,-7.68; 29 -4.5,-7.68; 30 -4,-7.68; 31 -3.5,-7.68; 32 -3,-7.68; 33 -2.5,-7.68; 34 -2,-7.68; 35 -1.5,-7.68; 36 -1,-7.68; 37 -0.5,-7.68; 38 0,-7.68; 39 0.5,-7.68; 40 1,-7.68; 41 1.5,-7.68; 42 2,-7.68; 43 2.5,-7.68; 44 3,-7.68; 45 3.5,-7.68; 46 4,-7.68; 47 4.5,-7.68; 48 5,-7.68; 49 5.5,-7.68; 50 6,-7.68; 76 6,7.68; 77 5.5,7.68; 78 5,7.68; 79 4.5,7.68; 80 4,7.68; 81 3.5,7.68; 82 3,7.68; 83 2.5,7.68; 84 2,7.68; 85 1.5,7.68; 86 1,7.68; 87 0.5,7.68; 88 0,7.68; 89 -0.5,7.68; 90 -1,7.68; 91 -1.5,7.68; 92 -2,7.68; 93 -2.5,7.68; 94 -3,7.68; 95 -3.5,7.68; 96 -4,7.68; 97 -4.5,7.68; 98 -5,7.68; 99 -5.5,7.68; 100 -6,7.68
JST-PH3 = drill 0.813 pad 1.676 octagon: 1 3,0; 2 1,0; 3 -1,0
CM7VT1A32768KHZ125PF10PPMTBQC = smd 1 x 1.8: 1 -1.25,0; 2 1.25,0
ATS041C-E = drill 0.68 pad 1.15: 1 -2.44,0; 2 2.44,0

### Placement (x,y rotation side)
C1  44.2,30.23 90 top
C2  48.01,35.31 180 top
C3  42.98,33.32 90 top
C4  44.2,33.27 90 top
C5  13,49.33 180 top
C6  12.7,50.95 180 top
C7  44.2,19.86 90 top
C8  48.01,25.65 180 top
C9  42.93,22.91 90 top
C10  44.2,22.91 90 top
C11  19.99,49.33 180 top
C12  19.68,50.95 180 top
C13  44.2,10.41 90 top
C14  48.01,15.49 180 top
C15  42.93,13.51 90 top
C16  44.2,13.51 90 top
C17  26.72,49.33 180 top
C18  26.42,50.95 180 top
C19  60.45,48.34 90 top
C20  58.86,48.34 90 top
C21  60.45,43.64 90 top
C22  58.86,43.64 90 top
C23  60.45,38.81 90 top
C24  58.86,38.81 90 top
C25  46.51,40.03 90 top
C26  37.97,41.66 180 top
C27  48.59,39.73 90 top
C28  38.23,39.83 180 top
C29  38.2,38.56 180 top
C30  23.9,35.59 90 top
C31  18.8,19.05 270 top
C32  38.18,37.13 180 top
C33  40.39,31.55 90 top
C34  18.77,28.96 90 top
C35  24.79,11.84 270 top
C36  36.96,12.14 270 top
C37  38.18,35.61 180 top
C38  16.46,15.52 270 top
C39  15.11,15.52 270 top
C40  26.19,11.84 90 top
C41  41.38,28.8 180 top
C42  35.13,12.14 90 top
C43  13.49,7.98 0 top
C44  44.83,51.1 0 top
C45  44.55,53.19 0 top
C46  9.09,28.98 0 top
C47  9.14,26.44 0 top
C48  23.52,3.68 90 top
C49  18.77,25.4 270 top
C50  18.77,22.25 90 top
D1  43.94,46.25 90 top
F1  43.94,40.16 270 top
H1  59.44,3.68 0 top
H2  59.44,56.13 0 top
H3  3.81,56.13 0 top
H4  3.81,3.81 0 top
IC2  41.43,38.73 0 top
J1  42.57,59.77 180 top
JP1  23.65,39.6 180 top
JP3  47.37,1.91 0 top
JP4  30.38,39.7 0 top
LED1  2.84,30.61 270 top
LED2  2.84,32.13 270 top
LED3  2.84,33.66 270 top
LED4  2.84,35.18 270 top
LED5  2.84,36.7 270 top
LED6  2.84,38.23 270 top
LED7  46.74,44.91 0 top
LED8  55.12,16.87 0 top
P1  2.29,14.48 270 top
P2  2.29,45.59 270 top
Q1  58.09,21.01 0 top
R1  43.56,35.43 0 top
R2  51.56,30.61 90 top
R3  44.2,26.11 270 top
R4  16.64,46.23 90 top
R5  51.36,20.96 90 top
R6  43.64,16 0 top
R7  9.65,46.23 90 top
R8  23.37,46.23 90 top
R9  51.56,10.8 90 top
R10  52.91,48.02 270 top
R11  52.91,43.32 270 top
R12  52.91,38.49 270 top
R13  18.31,14.78 270 top
R14  16.76,7.98 0 top
R15  25.3,35.59 270 top
R16  22.38,35.61 90 top
R17  30.25,35.46 270 top
R18  31.78,35.46 90 top
R19  6.4,30.61 180 top
R20  6.4,32.13 180 top
R21  6.4,33.66 180 top
R22  6.4,35.18 180 top
R23  6.4,36.7 180 top
R24  6.4,38.23 180 top
R25  27.2,35.46 90 top
R26  28.6,35.46 90 top
R27  25.02,3.68 270 top
R28  22.83,8.1 180 top
R29  41.02,5.59 270 top
R30  43.56,5.59 90 top
R31  48.64,5.46 90 top
R32  51.18,5.59 90 top
R33  53.47,5.59 90 top
R34  46.74,47.9 270 top
R35  33.45,12.14 270 top
R36  32.11,12.14 270 top
R37  56.39,16.87 270 top
R38  55.19,24.23 180 top
R39  55.04,20.17 270 top
S1  12.7,3.3 0 top
S2  19.38,3.23 0 top
U1  48.01,31.5 90 top
U2  12.7,46.1 270 top
U3  48.01,21.84 90 top
U4  19.68,46.1 270 top
U5  48.01,11.68 90 top
U6  26.42,46.1 270 top
U7  56.08,49.61 180 top
U8  56.08,44.91 180 top
U9  56.08,40.08 180 top
U10  29.74,23.77 0 top
U$1  32,57.66 180 top
U$2  60.96,29.34 90 top
U$3  30.86,2.29 0 top
U$4  61.26,12.65 90 top
Y1  11.73,27.71 90 top
Y2  15.44,23.67 90 top

### Tracks (layer width: path | path; a pad name or v marks a point on that pad's centre or on a via)
+5V  (via drill 0.6)
  Top 0.254: IC2.6 42.91,39.14 43.18,38.86 | 43.18,38.86 42.65,38.34 IC2.4 | F1.2 43.4,38.64 43.18,38.86
  Top 0.406: F1.2 44.02,38.64 44.09,38.71
  Top 0.61: 44.09,38.71 46.14,38.71 C25.1 C27.1 48.6,39.06 49.5,39.06 49.89,39.45 v49.89,40.44
  Bottom 0.61: U$4.3 58.02,11.65 56.97,12.7 56.97,37.92 58.27,39.22 58.27,51.03 57.05,52.25 51.33,52.25 49.89,50.8 v49.89,40.44
BME280_1_CS  (via drill 0.33)
  Top 0.203: 53.52,49.28 53.52,49.3 v52.98,49.84 | v40.08,26.57 39.88,26.57 39.22,25.91 39.22,25.76 38.74,25.27 U10.66
  Top 0.305: U7.P$2 53.52,49.28 R10.1
  Bottom 0.203: v52.98,49.84 52.98,46.03 52.38,45.42 52.38,38.3 46.23,32.16 44.6,32.16 42.98,30.53 42.98,29.46 v40.08,26.57
BME280_2_CS  (via drill 0.33)
  Top 0.203: U10.65 39,24.77 v39.83,25.6 | v53.39,45.31 53.39,44.71 53.52,44.58
  Top 0.305: U8.P$2 53.52,44.58 R11.1
  Bottom 0.203: v39.83,25.6 39.93,25.6 43.48,29.16 43.48,30.33 44.75,31.6 46.48,31.6 52.88,38 52.88,44.81 v53.39,45.31
BME280_3_CS  (via drill 0.33)
  Top 0.203: U10.64 39.67,24.27 v39.83,24.44
  Top 0.305: U9.P$2 v54.05,39.76 53.52,39.76 R12.1
  Bottom 0.203: v54.05,39.76 53.39,39.1 53.39,37.34 48.41,32.36 48.26,32.36 46.99,31.09 45.01,31.09 44.04,30.12 44.04,28.65 v39.83,24.44
BOOT0  (via drill 0.33, 0.35)
  Top 0.203: U10.94 26.74,33.2 v26.42,33.53
  Top 0.254: JP1.1 25.3,39.22 R15.1 26.1,36.23 v26.26,36.07
  Bottom 0.254: v26.42,33.53 26.26,33.68 v26.26,36.07
GND  (via drill 0.33, 0.35)
  Top 0.254: U9.P$1 55.87,39.11 56.52,39.76 U9.P$7 | R18.1 32.81,34.81 v33.04,34.57 | R29.1 40.51,6.75 v40.51,7.37
  Top 0.305: U7.P$7 58.77,49.28 C20.2 C19.2 | U8.P$7 58.77,44.58 C22.2 C21.2 | U9.P$7 58.77,39.76 C24.2 C23.2
  Top 0.406: v14.86,47.5 14.86,47.36 U2.16 | v21.72,47.5 21.72,47.12 21.6,47.12 U4.16
  other vias: 25.02,33.4 25.91,29.97 15.11,44.58 28.57,47.62 32.89,27.43 32.89,25.91 31.88,26.67 31.88,25.15 32.89,24.38 31.88,23.62 32.89,22.86 31.88,22.1 32.89,21.34 25.15,26.42 25.91,27.43 26.67,26.42 19.81,25.15 41.78,24.13 39.24,21.34 39.24,20.32 40,17.78 42.8,17.78 39.5,16 46.35,18.8 46.1,28.7 42.29,10.92 43.05,11.68 14.78,38.02 16.97,26.04 15.44,28.93 37.08,43.33 35.79,38.91 35.79,36.78 38,30.91 33.73,35.56 33.91,23.62 34.92,22.86 33.91,22.1 34.92,21.34 33.91,20.57 31.88,20.32 33.91,25.15 33.91,26.67 25.91,25.4 25.91,23.88 26.92,24.64 26.92,22.86 25.91,22.1 27.69,27.43 31.75,28.19 29.21,21.08 29.97,20.32 29.21,19.3
  pour Top: -1.52,61.98 64.77,61.98 64.77,-1.52 -1.52,-1.52
  pour Bottom: -2.03,61.98 64.52,61.98 64.52,-1.52 -2.03,-1.52
L3G4200D_1_CS  (via drill 0.33)
  Top 0.203: U10.63 38.86,23.77 v38.96,23.67 | U1.5 49.23,30.52 49.02,30.73 49.02,31.45 48.92,31.55 v48.67,31.55
  Top 0.305: R2.1 50.99,29.96 50.42,30.53 U1.5
  Bottom 0.203: v48.67,31.55 48.16,31.55 47.29,30.68 45.21,30.68 44.45,29.92 44.45,28.04 40.08,23.67 v38.96,23.67
L3G4200D_2_CS  (via drill 0.33)
  Top 0.203: U10.34 27.74,17.58 v27.79,17.63 | v44.4,17.88 48.77,17.88 49.83,18.95 49.83,20.22 | 49.83,20.22 49.83,20.85 U3.5 | 49.83,20.22 49.92,20.3 R5.1
  Bottom 0.203: v27.79,17.63 27.79,17.58 28.09,17.27 32.11,17.27 33.68,18.85 43.43,18.85 v44.4,17.88
L3G4200D_3_CS  (via drill 0.33)
  Top 0.203: v43.99,8.18 44.25,7.93 50.19,7.93 51.56,9.3 R9.1 | U10.33 27.24,14.92 27.48,14.68 v28.19,14.68
  Top 0.305: R9.1 50.99,10.15 50.42,10.72 49.87,10.72 U5.5
  Bottom 0.203: v43.99,8.18 41.55,10.62 41.55,15.09 38.25,18.39 33.88,18.39 32.36,16.87 30.38,16.87 28.32,14.81 v28.19,14.68
LIS3DSH_1_CS  (via drill 0.33)
  Top 0.203: R7.1 9.65,42.52 v9.96,42.22 | v19.96,21.29 22.05,21.29 U10.18
  Top 0.305: U2.8 9.67,45.6 R7.1
  Bottom 0.203: v9.96,42.22 9.96,38.3 17.98,30.28 17.98,23.27 v19.96,21.29
LIS3DSH_2_CS  (via drill 0.33)
  Top 0.203: U10.17 20.44,21.77 v20.01,22.2 | v16.66,42.32 16.66,45.55 R4.1
  Top 0.305: U4.8 16.66,45.6 R4.1
  Bottom 0.203: v20.01,22.2 18.44,23.77 18.44,40.54 v16.66,42.32
LIS3DSH_3_CS  (via drill 0.33)
  Top 0.203: R8.1 23.37,45.26 23.32,45.21 23.32,43.38 v22.1,42.16 | 20.93,22.35 v20.62,22.66 21.01,22.27 U10.16
  Top 0.305: U6.8 23.39,45.6 R8.1
  Bottom 0.203: v22.1,42.16 19,39.06 19,24.28 v20.62,22.66
N$10
  Top 0.203: U10.49 35.24,13.11 C42.2
N$11
  Top 0.305: U10.21 22.06,19.44 U10.22
  Top 0.406: 22.06,19.44 22,19.51 20.57,19.51 20.37,19.3 20.37,17.07 19.51,16.21 R13.1 16.49,16.21 C38.1 C39.1
N$12
  Top 0.305: U10.73 39.49,28.77
  Top 0.406: 39.49,28.77 40.5,28.77 C41.2
N$13
  Top 0.254: R16.2 JP1.2
N$14
  Top 0.254: LED1.C R19.2
N$15
  Top 0.254: R18.2 31.65,36.23 JP4.2
N$16
  Top 0.254: LED2.C R20.2
N$17
  Top 0.254: LED3.C R21.2
N$18
  Top 0.254: R22.2 LED4.C
N$19
  Top 0.254: LED5.C R23.2
N$20
  Top 0.203: R23.1 7.67,36.7 10.05,34.33 10.95,33.43 12.72,31.65 20.01,31.65 21.03,30.63 21.03,29.97 21.23,29.77 U10.1
N$21
  Top 0.254: LED6.C R24.2
N$22
  Top 0.203: R22.1 7.44,35.18 11.33,31.29 19.86,31.29 20.68,30.48 20.68,29.36
  Top 0.254: 20.68,29.36 20.76,29.27 U10.2
N$23
  Top 0.203: R21.1 8.28,33.66 8.88,33.06 9.27,32.66 11,30.94 19.71,30.94 20.32,30.33 20.32,29.01 20.55,28.77 U10.3
N$24
  Top 0.203: U10.4 20.44,28.27 19.96,28.75 19.96,30.18 19.56,30.58 9.45,30.58 7.92,32.11 7.08,32.11 R20.1
N$25
  Top 0.203: U10.5 20.33,27.77 19.61,28.5 19.61,30.02 19.41,30.23 8.79,30.23 8.38,30.63 7.08,30.63 R19.1
N$26
  Top 0.203: U10.8 22.05,26.26 20.47,26.26 19.18,27.56 13.99,27.56 12.78,28.78 11.92,28.78 Y1.2
  Top 0.254: C46.2 11.71,28.98 Y1.2
N$27
  Top 0.203: U10.9 20.43,25.77 19.02,27.18 13.39,27.18 12.7,26.49 11.77,26.49 Y1.1
  Top 0.254: C47.2 11.71,26.44 Y1.1
N$28
  Top 0.203: S2.3 S2.4 23.33,2.15 23.52,2.34 C48.1 R27.2
N$29
  Top 0.203: R29.2 JP3.1
N$30
  Top 0.203: R30.1 JP3.2
N$31
  Top 0.203: R31.1 JP3.4
N$32
  Top 0.203: R32.1 JP3.5
N$33
  Top 0.203: R33.1 53.47,2.16 JP3.6
N$34
  Top 0.203: C49.2 16.81,24.75 Y2.2
  Top 0.254: U10.12 21.39,24.27 21.39,24.28 19.24,24.28 C49.2
N$35
  Top 0.203: U10.13 19.64,23.77 C50.2 17.11,22.9 Y2.1
N$37
  Top 0.254: R34.2 LED7.C
N$40
  Top 0.254: Q1.1 57.14,17.53 R37.1
N$41
  Top 0.254: LED8.C R39.2
NRST  (via drill 0.33)
  Top 0.203: C43.2 14.76,7.98 | 14.76,7.98 R14.1 16.11,9.66 v16.15,9.7 | S1.2 14.9,7.83 14.76,7.98 | U10.14 22.05,23.27 v23.57,23.27 | R32.2 50.1,6.24 v49.94,6.4
  Top 0.254: S1.2 S1.1
  Bottom 0.203: v23.57,23.27 23.57,12.5 | 23.57,12.5 23.57,10.21 23.06,9.7 v16.15,9.7 | v49.94,6.4 42.57,6.4 39.73,9.25 39.73,12.7 37.29,15.14 31.6,15.14 28.85,12.4 23.67,12.4 23.57,12.5
PA0/WKUP
  Top 0.203: R28.2 22.18,16.09 23.14,17.04 23.14,18.57 22.93,18.77 U10.23
PB2/BOOT1  (via drill 0.33, 0.35)
  Top 0.203: v28.35,25.2 28.35,18.44 29.24,17.54 U10.37
  Top 0.254: R17.1 30.23,36.13 30.23,37.85 | JP4.1 30.23,38.58 30.23,37.85 | v29.46,36.83 29.46,37.08 30.23,37.85
  Bottom 0.203: 29.44,36.04 29.31,35.92 29.31,33.33 28.35,32.36 v28.35,25.2
  Bottom 0.254: 29.44,36.04 29.46,36.07 v29.46,36.83
PLL
  Top 0.254: U1.14 45.5,31.82 44.75,32.56 44.26,32.56 C4.1 43.03,32.62 C3.1
PLL1
  Top 0.254: C9.1 C10.1 44.29,22.17 U3.14
PLL2
  Top 0.203: C15.1 C16.1
  Top 0.254: U5.14 44.48,12.01 44.2,12.29 C16.1
PLL-1
  Top 0.254: R3.2 C10.2
PLL-2
  Top 0.254: C4.2 44.2,35.42 R1.2
PLL-3
  Top 0.254: C16.2 44.2,15.91 R6.2
PWM1  (via drill 0.33)
  Top 0.203: v30.73,18.19 30.73,16.1 U10.40
  Bottom 0.203: v30.73,18.19 30.73,31.9 31.04,32.21 31.04,34.44 33.98,37.39 33.98,56.68 U$1.3
PWM2  (via drill 0.33)
  Top 0.203: U10.41 31.24,17.63 v31.8,18.19 | v43.13,25.6 43.13,27.13 43.94,27.94 60.56,27.94 U$2.3
  Bottom 0.203: v31.8,18.19 32.26,18.19 33.43,19.36 40.23,19.36 43.13,22.25 v43.13,25.6
PWM3  (via drill 0.33)
  Top 0.203: U10.42 31.74,14.42 30.99,13.67 v30.99,12.4
  Bottom 0.203: U$3.3 30.99,3.41 v30.99,12.4
S.BUS_RX
  Top 0.254: U$4.2 58.69,13.65 56.39,15.95 R37.2 55.22,16.22 LED8.A
SCL1  (via drill 0.33)
  Top 0.254: R26.1 v28.6,33.48 27.74,32.62 U10.92
  Bottom 0.254: P2.3 6.7,46.59 9.85,43.43 26.97,43.43 27.79,42.62 27.79,38.25 28.6,37.44 v28.6,33.48
SCL2  (via drill 0.33)
  Top 0.203: U10.47 34.24,15.14 33.43,14.33 v33.12,14.33 32.11,13.31 R36.1
  Bottom 0.203: P1.3 9.06,15.48 15.75,8.79 25.3,8.79 28.45,11.94 28.96,11.94 31.75,14.73 32.71,14.73 v33.12,14.33
SDA1  (via drill 0.33)
  Top 0.254: v27.53,33.43 27.28,33.43 27.28,34.73 27.24,34.77 | 27.24,34.77 R25.1 | 27.24,34.77 U10.93
  Bottom 0.254: P2.2 7.88,44.59 9.5,42.98 26.62,42.98 27.33,42.27 27.33,33.63 v27.53,33.43
SDA2  (via drill 0.33)
  Top 0.203: U10.48 34.74,14.68 v34.42,14.35 | 34.59,14.53 33.43,13.36 33.43,12.82 R35.1
  Top 0.254: v34.42,14.35 34.59,14.53
  Bottom 0.203: P1.2 10.35,13.48 15.49,8.33 25.7,8.33 28.8,11.43 29.16,11.43 31.44,13.72 33.78,13.72 v34.42,14.35
SPI1_MISO  (via drill 0.33)
  Top 0.203: U1.4 v48.98,28.64 v48.97,28.63 | v48.97,8.66 48.97,9.82 U5.4 | U3.4 v48.98,19.03 v48.97,19.03 | U2.7 11.35,46.05 12.93,46.05 v13,45.97 | v20.24,46.08 20.19,46.03 18.36,46.03 U4.7 | v26.87,46.05 25.07,46.05 U6.7
  Top 0.254: U10.31 26.24,14.7 v26.26,14.68
  Bottom 0.203: v48.97,28.63 v48.97,19.03 v48.97,8.66 48.92,8.61 48.92,8.08 47.85,7.01 43.76,7.01 40.64,10.14 40.64,13.11 37.74,16 31.14,16 28.5,13.36 27.18,13.36 26.26,14.28 v26.26,14.68 26.26,20.42 29.46,23.62 29.46,32.11 30.23,32.87 30.23,34.9 33.17,37.85 33.17,41.66 30.43,44.4 28.52,44.4 v26.87,46.05 20.27,46.05 v20.24,46.08 20.19,46.03 13,46.03 v13,45.97
SPI1_MOSI  (via drill 0.33)
  Top 0.203: U5.3 48.33,10.75 v48.28,10.8 | v48.36,30.68 48.36,29.68 U1.3 | U3.3 48.33,21.04 v48.28,21.08 | v25.96,46.61 U6.6 | v27.63,13.97 26.79,14.81 26.79,16.04 U10.32 26.74,19.07 v26.92,19.25
  Top 0.254: U2.6 v12.31,46.6 v12.32,46.61 | v19.3,46.61 U4.6
  Bottom 0.203: v48.36,30.68 48.28,30.61 v48.28,21.08 v48.28,10.8 48.31,10.77 48.31,8.18 47.6,7.47 43.84,7.47 41.15,10.16 41.15,13.31 37.95,16.51 30.89,16.51 28.35,13.97 v27.63,13.97 | 19.56,46.61 19.63,46.69 25.88,46.69 v25.96,46.61 27.15,46.61 28.85,44.91 30.68,44.91 33.58,42.01 33.58,37.64 30.63,34.7 30.63,32.56 29.92,31.85 29.92,23.22 26.92,20.22 v26.92,19.25
  Bottom 0.254: v12.32,46.61 v19.3,46.61 19.56,46.61
SPI1_SCK  (via drill 0.33)
  Top 0.203: U1.2 v47.68,28.71 v47.68,28.7 | U5.2 v47.68,8.66 44.73,8.66 44.35,9.04 42.11,9.04 v41.5,8.43 | U3.2 v47.68,19.03 | U2.4 12.2,48.17 v12.32,48.28 | v25.88,48.28 25.88,47.53 U6.4 | U4.4 19.18,48.22 v19.25,48.28 | U10.30 25.69,16.04 25.69,14.03 v25.76,13.97
  Bottom 0.203: v47.68,28.7 v47.68,19.03 v47.68,8.66 | v25.88,48.28 v19.25,48.28 v12.32,48.28 12.17,48.28 11.48,47.6 11.48,44.86 12.45,43.89 30.23,43.89 32.77,41.35 32.77,38.1 29.77,35.1 29.77,33.12 28.96,32.31 28.96,23.83 25.65,20.52 25.65,14.07 v25.76,13.97 26.82,12.9 28.7,12.9 31.34,15.55 37.59,15.55 40.18,12.95 40.18,9.7 41.45,8.43 v41.5,8.43
SPI3_MISO  (via drill 0.33)
  Top 0.203: U7.P$5 56.96,50.58 v56.44,51.11 | v56.69,41.83 56.69,41.12 57.04,41.12 U9.P$5 | U8.P$5 56.86,45.88 v56.44,46.3 | U10.90 28.74,30.29 29.11,29.92 v31.29,29.92
  Bottom 0.203: v56.69,41.83 56.69,46.05 v56.44,46.3 v56.44,51.11 56.44,51.16 56.13,51.46 52.27,51.46 51.16,50.34 51.16,39.52 45.57,33.93 36.32,33.93 35.86,34.39 33.98,34.39 33.68,34.09 33.68,32.31 v31.29,29.92
SPI3_MOSI  (via drill 0.33)
  Top 0.203: U8.P$3 55.52,45.23 55.83,45.54 v55.83,45.7 | v55.83,50.34 55.83,50.19 55.6,49.96 55.09,49.96 U7.P$3 | U9.P$3 55.49,40.41 55.91,40.82 v55.91,40.89 | v34.49,33.73 29.72,33.73 28.55,32.56 28.4,32.56 28.24,32.41 U10.91
  Bottom 0.203: v55.91,40.89 55.91,45.62 v55.83,45.7 v55.83,50.34 55.83,50.44 55.22,51.05 52.53,51.05 51.56,50.09 51.56,39.27 45.82,33.53 35.92,33.53 35.71,33.73 v34.49,33.73
SPI3_SCK/SWO  (via drill 0.33)
  Top 0.203: U7.P$4 54.24,50.58 v54.15,50.5 | v54.15,40.89 54.15,40.97 54.23,41.05 U9.P$4 | U8.P$4 54.19,45.88 v54.15,45.92 | U10.89 29.24,32.44 29.92,33.12 v35.2,33.12 | v53.44,7.67 53.44,6.26 R33.2
  Bottom 0.203: v35.2,33.12 46.18,33.12 51.97,38.91 51.97,45.62 52.02,45.67 52.02,49.94 52.58,50.5 v54.15,50.5 v54.15,45.92 v54.15,40.89 54.61,40.89 54.86,40.64 54.86,9.09 v53.44,7.67
SWCLK/PA14  (via drill 0.33)
  Top 0.203: R30.2 43.56,7.09 43.08,7.57 41.4,7.57 40.59,8.38 40.59,10.52 41.6,11.53 41.6,22.56 v41.66,22.61 | 35.71,30.12 35.66,30.07 v35.66,30.02 35.74,30.11 U10.76
  Bottom 0.203: v41.66,22.61 36.47,22.61 34.85,24.23 34.85,29.21 v35.66,30.02
SWDIO/PA13
  Top 0.203: R31.2 47.95,6.1 47.45,5.59 40.28,5.59 39.73,6.15 39.73,10.36 41.05,11.68 41.05,26.67 39.44,28.27 U10.72
UART1_RX
  Top 0.254: R38.1 57.48,24.23 58.11,23.6 58.11,22.13 Q1.3
USB_D_N  (via drill 0.35)
  Top 0.15: v37.38,32.36 37.16,32.36 37.16,33.49 35.02,35.62 35.02,42.53 36.22,43.73 v36.13,43.83 | v42.64,53.24 42.67,53.27 42.67,53.81 43.09,54.23 43.09,55.51 J1.2 | U10.70 36.09,27.27 v35.88,27.07
  Bottom 0.15: v35.88,27.07 35.93,27.12 36.3,27.27 37.16,28.13 37.16,32.36 v37.38,32.36 | v36.13,43.83 36.13,43.89 42.67,50.43 42.67,53.21 v42.64,53.24
USB_D_P  (via drill 0.35)
  Top 0.15: U10.71 35.8,27.77 v35.68,27.89 | v36.63,32.36 36.86,32.36 36.86,33.36 34.72,35.5 34.72,43.42 35.63,44.33 v35.6,44.36 | v41.89,53.24 41.86,53.27 41.86,53.43 42.65,54.22 42.65,55.52 42.57,55.6 J1.3
  Bottom 0.15: v36.63,32.36 36.86,32.36 36.86,28.76 36.76,28.76 35.89,27.89 v35.68,27.89 | 35.6,44.3 v35.6,44.36 | 35.6,44.3 35.5,44.2 | 35.6,44.3 41.86,50.56 41.86,53.21 v41.89,53.24
VCC  (via drill 0.33, 0.5)
  Top 0.203: U10.19 | U10.6 20.17,27.27 19.3,28.14 18.93,28.14
  Top 0.254: U1.16 U1.15 | U3.15 U3.16 46.95,20.87 47.03,20.79 U3.1 | U5.16 U5.15 | U10.100 23.74,34.59 | U10.75 36.43,29.77 35.86,29.21 23.82,29.21 23.67,29.36 | 24.74,12.53 C35.1 | R17.2 29.9,34.81 R26.2 | R15.2 26.03,34.94 R25.2 | U10.19 20.52,20.78 19.46,19.71 18.81,19.71 C31.1 | U10.50 35.74,14.96 36.93,13.77 36.93,12.82 C36.1 36.71,12.55 36.32,12.55 35.92,12.14 33.53,12.14 33.45,12.07 R35.2 | U6.14 29.34,45.6 29.59,45.85 29.59,49.2 29.46,49.33 | 22.1,49.4 22.1,49.38 v22.15,49.33 | R38.2 54.25,24.23 v52.93,25.55 | 18.93,28.14 C34.1 | 40.78,38.95 IC2.2 | C40.2 25.91,12.49
  Top 0.305: U2.14 15.07,45.6 15.24,45.77 15.24,46.89 15.25,46.88 R4.2 | U4.1 | R8.2 23.36,46.89 22.3,46.89 22.3,46.03 21.89,45.62 21.28,45.62 21.27,45.6 U4.14 | U6.1 | U10.6 23.63,27.27 23.67,27.23 | IC2.1 40.78,38.95 40.74,38.91
  Top 0.406: U1.1 47.03,30.52 U1.16 45.21,29.58 | U2.1 13.7,49.21 C5.1 | C5.1 13.58,50.92 C6.1 | U4.1 20.68,49.21 C11.1 | C11.1 20.57,50.92 C12.1 | U5.1 47.03,10.71 U5.16 v45.21,9.76 C13.1 | U6.1 27.42,49.21 C17.1 | C17.1 27.3,50.92 C18.1 | C19.1 C20.1 57.11,47.49 | R10.2 52.91,47.49 56.08,47.49 | 56.08,47.49 57.11,47.49 | U7.P$8 57.11,47.49 | U7.P$6 56.41,49.93 56.08,49.61 56.08,47.49 | C21.1 60.37,42.79 C22.1 57.11,42.79 | R11.2 52.91,42.79 56.08,42.79 | 56.08,42.79 57.11,42.79 | U8.P$8 57.11,42.79 | U8.P$6 56.41,45.23 56.08,44.91 56.08,42.79 | C23.1 C24.1 57.11,37.96 | R12.2 52.91,37.96 57.11,37.96 | U9.P$8 57.11,37.96 | 28.19,49.33 C17.1 | R7.2 9.65,49.07 v9.91,49.33 | C5.1 v14.88,49.33 15.75,49.33 16.64,48.44 R4.2 | C11.1 v22.15,49.33 | R9.2 52.74,11.45 v52.93,11.63 | C14.1 52.68,15.49 v52.93,15.24 | C8.1 52.83,25.65 v52.93,25.55 | R2.2 52.85,31.26 v52.93,31.34 | U10.100 23.67,31.45 23.67,29.36 23.67,27.23 23.67,25.04 | 24.74,20.73 U10.28 24.74,12.53 C35.1 | 24.74,20.73 24.74,23.97 23.67,25.04 | U10.19 24.69,20.78 24.74,20.73 | U10.11 23.4,24.77 23.67,25.04 | U10.75 38.56,29.77 39.67,30.89 | 23.74,34.59 23.74,34.78 C30.1 | R8.2 23.37,48.13 22.1,49.4 | U3.16 46.16,20.6 v45.26,19.71 44.76,19.21 C7.1 | R5.2 52.8,21.61 v52.93,21.74
  Top 0.61: C19.1 61.53,47.49 62.03,46.99 62.03,42.82 | 62.03,42.82 62.03,41.15 | 62.03,41.15 62.03,38.2 61.77,37.95 60.46,37.95 C23.1 | 60.37,42.79 61.99,42.79 62.03,42.82 | C17.1 v28.96,49.33 29.46,49.33 32.77,49.33 38.91,43.18 38.91,41.67 C26.1 38.96,41.62 38.96,39.88 38.91,39.83 C28.1 38.88,39.24 39.21,38.91 | C2.1 52.68,35.31 v52.93,35.56 52.91,35.59 R12.2 45.97,37.84 45.21,37.08 38.88,37.08 C32.1 | C35.1 23.93,12.5 23.48,12.06 R28.1 23.52,8.07 C48.2 23.49,4.3 S2.2 S2.1 17.42,4.31 R14.2 | 40.74,38.91 39.21,38.91 | 39.21,38.91 C29.1 38.85,37.16 C32.1 | P1.4 2.09,17.67 LED1.A LED2.A LED3.A LED4.A LED5.A LED6.A 2.09,39.33 4.37,41.61 4.37,48.56 | 4.37,48.56 4.37,48.67 9.25,48.67 v9.91,49.33 | P2.4 4.34,48.59 4.37,48.56 | C30.1 R15.2 | R26.2 R25.2 27.2,42.14 28.02,42.95 32.51,42.95 35.71,46.15 | R35.2 R36.2 32.09,11.48 29.87,11.48 28.85,12.5 25.92,12.5 25.91,12.49 | R13.2 18.31,9.58 17.42,8.69 R14.2 | R14.2 | C32.1 C37.1 38.83,31.63 39.57,30.89 39.67,30.89 C33.1 40.43,30.94 42.01,30.94 43.37,29.58 C1.1 45.21,29.58 45.25,29.58 v45.26,29.57 | C40.2 C35.1 | U9.P$6 57.91,40.41 58.17,40.67 61.55,40.67 62.03,41.15
  Bottom 0.61: v9.91,49.33 v14.88,49.33 v22.15,49.33 v28.96,49.33 | v45.26,29.57 v45.26,19.71 45.26,9.82 v45.21,9.76
  Bottom 0.813: v52.93,35.56 v52.93,31.34 v52.93,25.55 v52.93,21.74 v52.93,15.24 v52.93,11.63
VIN
  Top 0.254: D1.1 46.69,44.2 LED7.A
  Top 0.61: D1.1 43.94,43.69 43.99,43.64
  Top 1.016: 43.99,43.64 43.99,41.73 F1.1
  Top 1.27: U$1.2 31,55 41.81,44.2 D1.1
VUSB
  Top 0.559: J1.1 43.87,54.46
  Top 0.61: 43.87,54.46
  Top 1.016: 43.87,54.46 43.87,53.22 C45.1
  Top 1.27: C45.1 43.9,51.12 C44.1 43.88,48.36 D1.2

### Text on the board
Top: Victor Covasan
tPlace: X | Y | GND 5V PWM | MOTOR3 | Z | AIR SPD SENSOR1 | BOOT0 BOOT1 | MOTOR2 | PWM 5V GND | AIR SPD SENSOR2 | Z | 5V RX GND | X | Y | MOTOR1 | PWM 5V GND | RESET WAKEUP | SWD
bPlace: 1 | 1 | 1